# Altium schematic sheet Antenna_sw.SchDoc
size A4
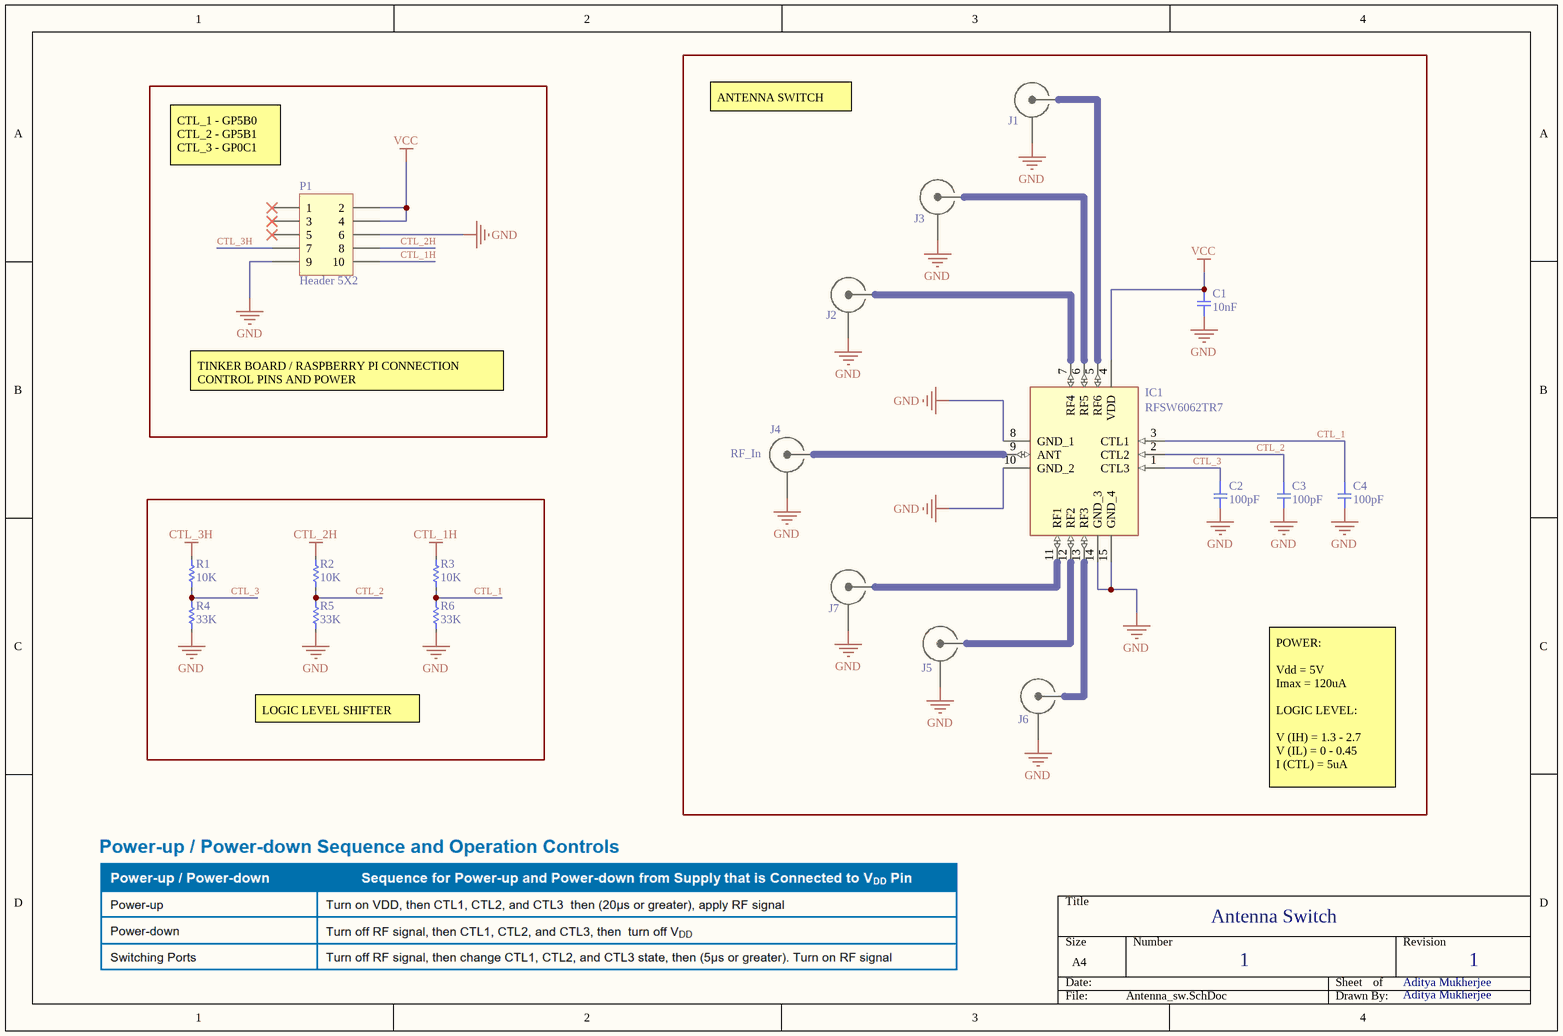
[diagram p0: Antenna_sw.SchDoc]

## Parts
C1  10nF  [SMD-0402C]
C2  100pF  [SMD-0402C]
C3  100pF  [SMD-0402C]
C4  100pF  [SMD-0402C]
IC1  RFSW6062TR7  [QFN40P200X200X60-15N-D]
J1  SMA_end_launch  [PCBComponent_1]  (value not drawn)
J2  SMA_end_launch  [PCBComponent_1]  (value not drawn)
J3  SMA_end_launch  [PCBComponent_1]  (value not drawn)
J4  value RF_In  [PCBComponent_1]  (hidden comment: SMA_end_launch)
J5  SMA_end_launch  [PCBComponent_1]  (value not drawn)
J6  SMA_end_launch  [PCBComponent_1]  (value not drawn)
J7  SMA_end_launch  [PCBComponent_1]  (value not drawn)
P1  Header 5X2  [HDR2X5]
R1  10K  [PCBComponent_1]
R2  10K  [PCBComponent_1]
R3  10K  [PCBComponent_1]
R4  33K  [PCBComponent_1]
R5  33K  [PCBComponent_1]
R6  33K  [PCBComponent_1]

## Nets
CTL_1H: P1.10 R3.2
CTL_2H: P1.8 R2.2
CTL_3H: P1.7 R1.2
GND: C1.2 C2.2 C3.2 C4.2 IC1.8(GND_1) IC1.10(GND_2) IC1.14(GND_3) IC1.15(GND_4) J1.2 J2.2 J3.2 J4.2 J5.2 J6.2 J7.2 P1.6 P1.9 R4.1 R5.1 R6.1
VCC: C1.1 IC1.4(VDD) P1.2 P1.4
CTL_1: C4.1 IC1.3(CTL1) R3.1 R6.2
CTL_2: C3.1 IC1.2(CTL2) R2.1 R5.2
CTL_3: C2.1 IC1.1(CTL3) R1.1 R4.2
NetIC1_5: IC1.5(RF6) J1.1
NetIC1_6: IC1.6(RF5) J3.1
NetIC1_7: IC1.7(RF4) J2.1
NetIC1_9: IC1.9(ANT) J4.1
NetIC1_11: IC1.11(RF1) J7.1
NetIC1_12: IC1.12(RF2) J5.1
NetIC1_13: IC1.13(RF3) J6.1

Not connected (* = marked no-connect by the designer): P1 1* 3* 5*

## Notes on the sheet
- ANTENNA SWITCH
- (near P1) CTL_1 - GP5B0
  CTL_2 - GP5B1
  CTL_3 - GP0C1
- TINKER BOARD / RASPBERRY PI CONNECTION
  CONTROL PINS AND POWER
- LOGIC LEVEL SHIFTER
- POWER:
  Vdd = 5V
  Imax = 120uA
  LOGIC LEVEL:
  V (IH) = 1.3 - 2.7
  V (IL) = 0 - 0.45
  I (CTL) = 5uA
- Antenna Switch
- 1
- Aditya Mukherjee

## Library data of the parts
C1-C4 = GCM155C71A105KE38D: CAP CER 1UF 10V X7S 0402; Manufacturer: Murata Electronics North America; Factory Stock: 0; Unit Price (USD): 0.12; Minimum Quantity: 1; Tolerance: ±10%; Datasheets: http://www.murata.com/~/media/webrenewal/support/library/catalog/products/capacitor/mlcc/c03e.ashx; Image: //media.digikey.com/Renders/Murata%20Renders/ZRB-SERIES-0402.jpg; Digi-Key Part Number: 490-13409-1-ND; Part Number: GCM155C71A105KE38D; Quantity Available: 7240; @ qty: 0; Packaging: Cut Tape (CT); Series: GCM; Part Status: Active; Voltage: 10V; Temperature Coefficient: X7S; Operating Temperature: -55°C ~ 125°C; Features: -; Ratings: AEC-Q200; Applications: Automotive; Mounting Type: Surface Mount, MLCC; Package / Case: 0402 (1005 Metric); Size / Dimension: 0.039" L x 0.020" W (1.00mm x 0.50mm); Height - Seated (Max): -; Thickness (Max): 0.022" (0.55mm); Lead Spacing: -; Lead Style: -
  C1: Value: 10nF
  C2-C4: Value: 100pF
IC1 = RFSW6062TR7: RF Switch; Manufacturer_Name: RFMD; Datasheet Link: https://componentsearchengine.com/Datasheets/1/RFSW6062TR7.pdf; Height: 0.6mm; Manufacturer_Part_Number: RFSW6062TR7; Mouser Part Number: 772-RFSW6062
J1-J7 = Component_1: Sma end launch female
P1 = Header 5X2: Header, 5-Pin, Dual row; LatestRevisionDate: 17-Jul-2002; LatestRevisionNote: Re-released for DXP Platform.; Publisher: Altium Limited
R1-R6 = Component_1
  R1-R3: value: 10K
  R4-R6: value: 33K